# EAGLE design Adafruit MICS-5524 (EAGLE 6.6.0)
COMPANY: ADAFRUIT INDUSTRIES; DRAWN: KTOWN; REV: A
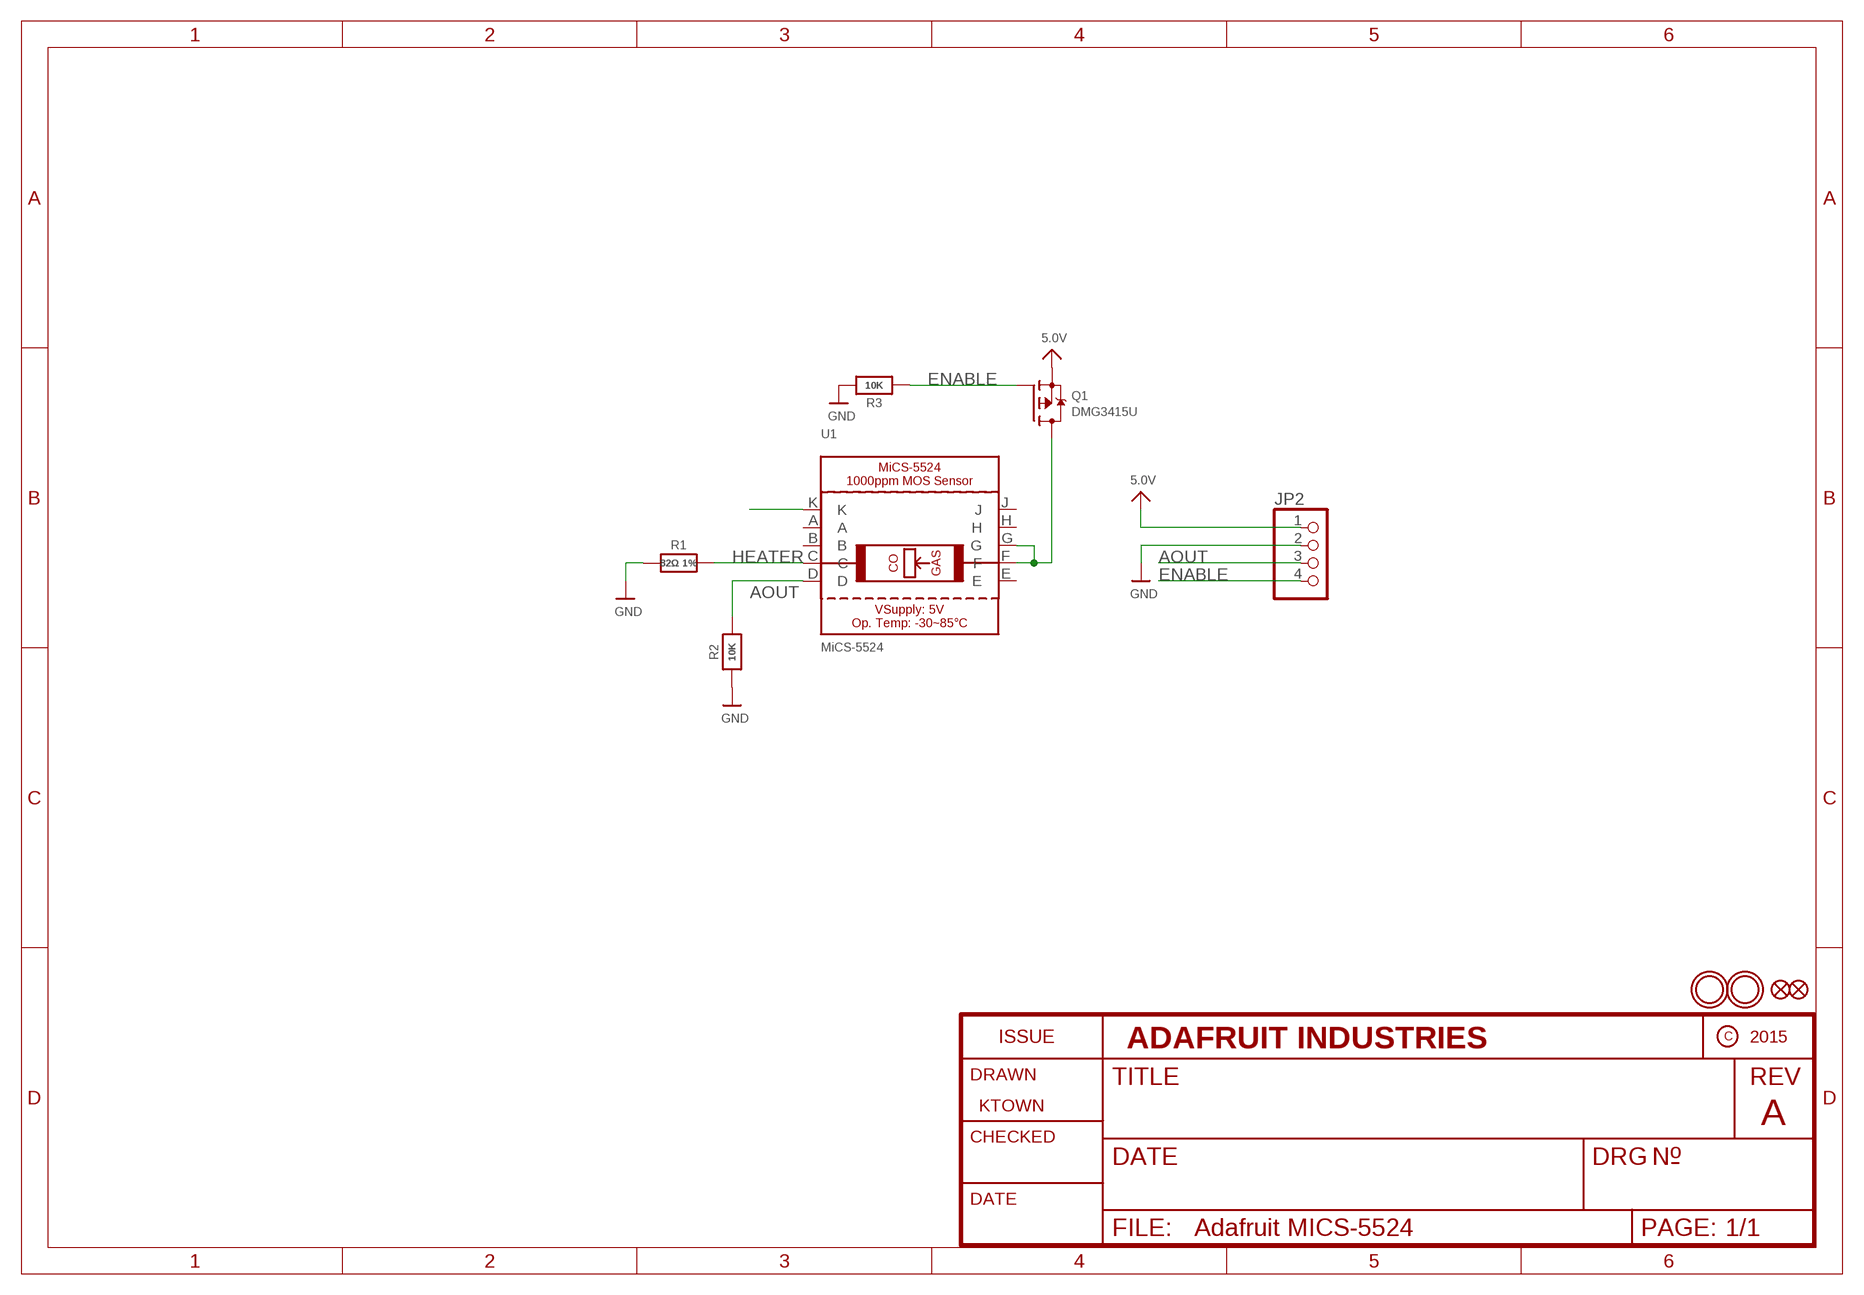
[diagram p0: schematic, sheet 1]

## Parts
FID1  FIDUCIAL""  [FIDUCIAL_1MM]
FID2  FIDUCIAL""  [FIDUCIAL_1MM]
JP2  HEADER-1X476MIL  [1X04_ROUND_76]
Q1  DMG3415U  MOSFET-PWIDE  [SOT23-WIDE]
R1  82Ω 1%  RESISTOR0805_NOOUTLINE  [0805-NO]
R2  10K  RESISTOR0805_NOOUTLINE  [0805-NO]
R3  10K  RESISTOR0805_NOOUTLINE  [0805-NO]
U1  MiCS-5524  MICS-5524  [MICS-5524]
U$3  MOUNTINGHOLE2.5  [MOUNTINGHOLE_2.5_PLATED]
U$4  MOUNTINGHOLE2.5  [MOUNTINGHOLE_2.5_PLATED]

## Nets
5.0V: JP2.1 Q1.2(S)
AOUT: JP2.3 R2.2 U1.D
ENABLE: JP2.4 Q1.1(G) R3.1
GND: JP2.2 R1.1 R2.1 R3.2
HEATER: R1.2 U1.C
N$1: U1.K
N$2: Q1.3(D) U1.F U1.G
Unconnected: U1.A U1.B U1.E U1.H U1.J

## Library data of the parts
FID1 FID2 = microbuilder:FIDUCIAL: Fiducial Alignment Points Various fiducial points for machine vision alignment.; BOM: EXCLUDE
JP2 = microbuilder:HEADER-1X4: PIN HEADER
Q1 = microbuilder:MOSFET-P: P-Channel Mosfet LEGEND VDS: Voltage Drain-Source ID: Drain Current RDS(ON): Drain-Source On-State Resistance VGS(TH): Gate-Source Threshold Voltage CISS: Drain-Source Input Capacitance SOT-23 Name VDS ID RDS(ON) VGS(TH) CISS Order Number IRLML5103 30V 760mA 600 mOhm -- 75pF @ 25V Digikey: IRLML5103PBFCT-ND IRLML6401 12V 4.3A 50 mOhm 950mV @ 250µA 830pF @ 10V Digikey: IRLML6401PBFTR-ND NTR0202PL 20V 400mA 800 mOhm 2.3V @ 250uA 70pF @ 5V Digikey: NTR0202PLT1GOSTR-ND NTR4101PT1G 20V 1.8A 85 mOhm 1.2V @ 250uA 675pF @ 10V Digikey: NTR4101PT1GOSCT-ND DMP2004K 20V 600mA 900 mOhm 1V @ 250uA 175pF @ 16V Digikey: DMP2004KDICT-ND PMV65XP 20V 3.9A 76 mOhm 950mV @ 1mA 725pF @ 20V Digikey: 568-2358-2-ND TO-252 Name VDS ID RDS(ON) VGS(TH) CISS Order Number AOD417 30V 25A 34 mOhm 3V @ 250µA 920pF @ 15V Digikey: 785-1106-2-ND
R1-R3 = microbuilder:RESISTOR: Resistors For new designs, use the packages preceded by an '_' character since they are more reliable: The following footprints should be used on most boards: _0402 - Standard footprint for regular board layouts _0603 - Standard footprint for regular board layouts _0805 - Standard footprint for regular board layouts _1206 - Standard footprint for regular board layouts For extremely tight-pitch boards where space is at a premium, the following 'micro-pitch' footprints can be used (smaller pads, no silkscreen outline, etc.): _0402MP - Micro-pitch footprint for very dense/compact boards _0603MP - Micro-pitch footprint for very dense/compact boards _0805MP - Micro-pitch footprint for very dense/compact boards _1206MP - Micro-pitch footprint for very dense/compact boards
U1 = microbuilder:MICS-5524: MiCS-5524 Carbon Monoxide Gas Sensor Co Detection Range: 1-1000ppm VSupply (Pin F): 4.9-5.1V Operating Temperature: -30~85°C
U$3 U$4 = microbuilder:MOUNTINGHOLE: Mounting Hole For #2 screws (0.086"/2.18mm width, 0.094"/2.4mm hole) use 2.5mm; BOM: EXCLUDE

## Board
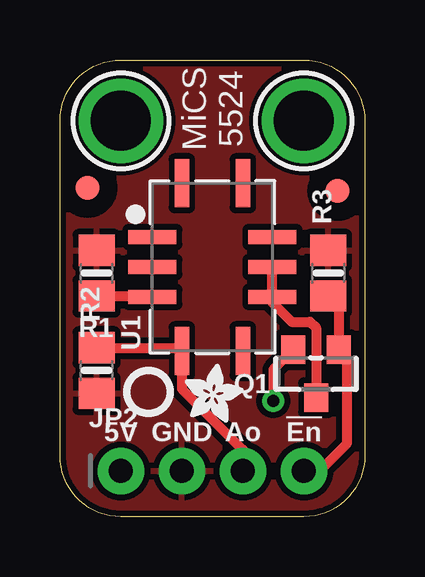
[diagram p1: board, top side]
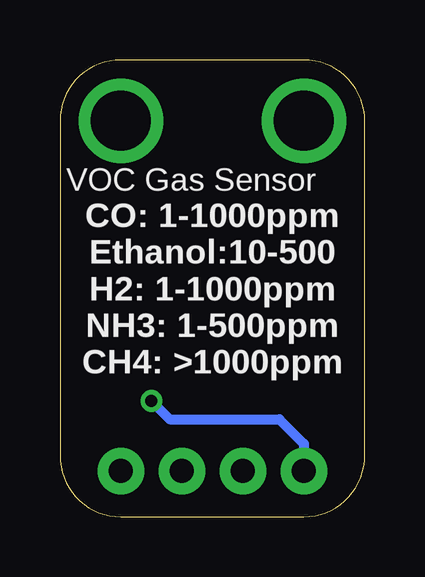
[diagram p2: board, bottom side, seen from below]

Size 12.7 x 19.05 mm. Coordinates in mm from the lower left corner, seen from the top.
Outline: 12.7,16.51 12.7,2.54 arc-90 10.16,0 2.54,0 arc-90 0,2.54 0,16.51 arc-90 2.54,19.05 10.16,19.05 arc-90 12.7,16.51
Copper layers (1*16): Top 0.035mm / dielectric 1.5mm / Bottom 0.035mm
Design rules "adafruit": minimum track width 8mil, minimum drill 15.5mil, track to track 8mil, track to pad 8mil, pad to pad 8mil, via to via 8mil, smd to smd 8mil, copper to edge 10mil, drill to drill 8mil, minimum pad ring 10mil, minimum via ring 8mil, stop-mask expansion 2mil, vias tented up to drill 20mil, thermal gap 10mil

### Footprints (pad centres in the part's own frame; a part is rotated, then mirrored left to right if it is on the bottom)
FIDUCIAL_1MM = smd 1 x 1: 1 0,0
1X04_ROUND_76 = drill 1 pad 1.93: 1 -3.81,0; 2 -1.27,0; 3 1.27,0; 4 3.81,0
SOT23-WIDE = smd 1 x 1.2: 1 -0.95,-1; 2 0.95,-1; 3 0,1
0805-NO = smd 1.3 x 1.5: 1 -0.95,0; 2 0.95,0
MICS-5524 = smd 0.6 x 2: A 1.25,2.5; B 0,2.5; C -1.25,2.5; F -1.25,-2.5; G 0,-2.5; H 1.25,-2.5 | smd 2 x 0.6: D -3.5,1.27; E -3.5,-1.27; J 3.5,-1.27; K 3.5,1.27
MOUNTINGHOLE_2.5_PLATED = drill 2.5 pad 3.2: P$1 0,0

### Placement (x,y rotation side)
FID1  11.56,13.59 0 top
FID2  1.14,13.72 0 top
JP2  6.35,1.91 0 top
Q1  10.67,5.97 180 top
R1  1.52,10.16 270 top
R2  1.52,6.1 90 top
R3  11.18,10.16 90 top
U1  6.35,10.41 90 top
U$3  2.54,16.51 0 top
U$4  10.16,16.51 0 top
U$7  [ADAFRUIT_2.5MM]  5.21,3.94 0 top
U$10  [PCBFEAT-REV-040]  3.68,5.21 0 top

### Tracks (layer width: path | path; a pad name or v marks a point on that pad's centre or on a via)
5.0V  (via drill 0.5)
  Top 0.406: Q1.2 8.89,6.14 v8.89,4.83
  Bottom 0.406: v8.89,4.83 8.13,4.06 3.56,4.06 2.54,3.05 JP2.1
AOUT
  Top 0.406: R2.2 5.08,7.05 U1.D 5.08,5.33 7.62,2.79 JP2.3
ENABLE
  Top 0.406: R3.1 11.62,9.21 Q1.1 11.94,6.52 11.94,3.05 10.67,1.78 JP2.4
GND
  pour Top (isolate 0.254): 0,0 0,16.51 arc-90 2.54,19.05 10.16,19.05 arc-90 12.7,16.51 12.7,0
HEATER
  Top 0.406: R1.2 3.85,9.21 U1.C
N$2
  Top 0.406: U1.G U1.F 8.85,8.93 9.65,8.13 10.41,8.13 10.67,7.87 Q1.3

### Text on the board
tPlace: MiCS / 5524 | 5V | GND | Ao | !En
bPlace: VOC Gas Sensor | CO: 1-1000ppm / Ethanol:10-500 / H2: 1-1000ppm / NH3: 1-500ppm / CH4: >1000ppm